# Altium schematic sheet LEDS AND DRIVER.SchDoc
size A4
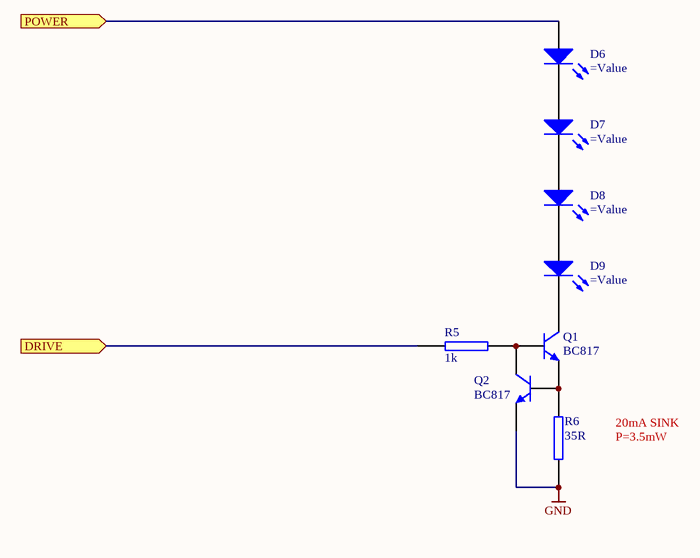
[diagram p0: LEDS AND DRIVER.SchDoc]

## Parts
D6  (no value)  [LED SUPERFLUX AMBER]
D7  (no value)  [LED SUPERFLUX AMBER]
D8  (no value)  [LED SUPERFLUX AMBER]
D9  (no value)  [LED SUPERFLUX AMBER]
Q1  BC817  [SOT23-3L]
Q2  BC817  [SOT23-3L]
R5  1k  [RES (3D) - 0805]
R6  35R  [RES (3D) - 0805]

## Ports
DRIVE (in), POWER (in)

## Nets
GND: Q2.2(E) R6.1
DRIVE: R5.2 ; port DRIVE
POWER: D6.1(A) ; port POWER
NetD6_2: D6.2(K) D7.1(A)
NetD7_2: D7.2(K) D8.1(A)
NetD8_2: D8.2(K) D9.1(A)
NetD9_2: D9.2(K) Q1.3(C)
NetQ1_1: Q1.1(B) Q2.3(C) R5.1
NetQ1_2: Q1.2(E) Q2.1(B) R6.2

## Notes on the sheet
- 20mA SINK
- P=3.5mW

## Library data of the parts
D6-D9 = LED 3mm RED: LED 55
Q1 Q2 = BC817: NPN Bipolar Transistor; Manufacturer: ON Semiconductor; Manufacturer Part No.: BC817-25LT1G; Revision: July-2002: Re-released for DXP Platform.; Mouser Part no.: 863-BC817-25LT1G; Farnell Part no.: 1081223; value: BC817; Web link: http://au.mouser.com/ProductDetail/ON-Semiconductor/BC817-25LT1G/?qs=sGAEpiMZZMutXGli8Ay4kJTaSFKHrKTHz5OxB%252bfaCCM%3d
R5 R6 = RES SMD 0603 1k: RESISTOR SMD 0603 1k
  R5: value: 1k
  R6: value: 35R